# EAGLE design PCB1 (EAGLE 9.6.2)

## Sheet 1 of 2: CONEXIONES
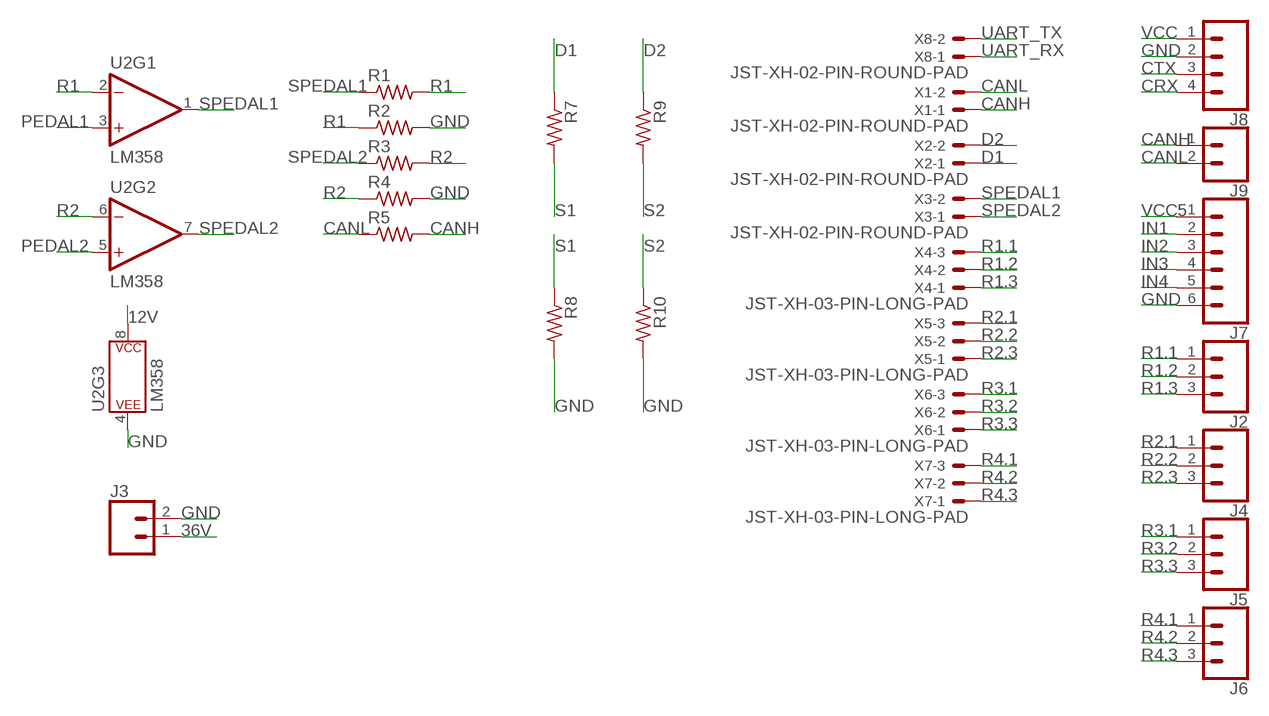
[diagram p0: schematic, sheet 1]

### Parts
J2  CONN_03  [1X03]
J3  CONN_025MM  [SCREWTERMINAL-5MM-2]
J4  CONN_03  [1X03]
J5  CONN_03  [1X03]
J6  CONN_03  [1X03]
J7  CONN_06SILK_FEMALE_PTH  [1X06]
J8  CONN_04  [1X04]
J9  CONN_02  [1X02]
R1  R-US_0207/10  [0207/10]
R2  R-US_0207/10  [0207/10]
R3  R-US_0207/10  [0207/10]
R4  R-US_0207/10  [0207/10]
R5  R-US_0207/10  [0207/10]
R7  R-US_0207/10  [0207/10]
R8  R-US_0207/10  [0207/10]
R9  R-US_0207/10  [0207/10]
R10  R-US_0207/10  [0207/10]
U2  LM358  [DIP08]
X1  JST-XH-02-PIN-ROUND-PAD  [JST-XH-02-PACKAGE-ROUND-PAD]
X2  JST-XH-02-PIN-ROUND-PAD  [JST-XH-02-PACKAGE-ROUND-PAD]
X3  JST-XH-02-PIN-ROUND-PAD  [JST-XH-02-PACKAGE-ROUND-PAD]
X4  JST-XH-03-PIN-LONG-PAD  [JST-XH-03-PACKAGE-LONG-PAD]
X5  JST-XH-03-PIN-LONG-PAD  [JST-XH-03-PACKAGE-LONG-PAD]
X6  JST-XH-03-PIN-LONG-PAD  [JST-XH-03-PACKAGE-LONG-PAD]
X7  JST-XH-03-PIN-LONG-PAD  [JST-XH-03-PACKAGE-LONG-PAD]
X8  JST-XH-02-PIN-ROUND-PAD  [JST-XH-02-PACKAGE-ROUND-PAD]

### Nets
12V: U2.8(P$V+) ; also sheet 2
36V: J3.1 ; also sheet 2
CANH: J9.1 R5.2 X1.1
CANL: J9.2 R5.1 X1.2
CRX: J8.4 ; also sheet 2
CTX: J8.3 ; also sheet 2
D1: R7.1 X2.1
D2: R9.1 X2.2
GND: J3.2 J7.6 J8.2 R2.2 R4.2 R8.2 R10.2 U2.4(P$V-) ; also sheet 2
IN1: J7.2 ; also sheet 2
IN2: J7.3 ; also sheet 2
IN3: J7.4 ; also sheet 2
IN4: J7.5 ; also sheet 2
PEDAL1: U2.3(+IN) ; also sheet 2
PEDAL2: U2.5(+IN) ; also sheet 2
R1: R1.2 R2.1 U2.2(-IN)
R1.1: J2.1 X4.3
R1.2: J2.2 X4.2
R1.3: J2.3 X4.1
R2: R3.2 R4.1 U2.6(-IN)
R2.1: J4.1 X5.3
R2.2: J4.2 X5.2
R2.3: J4.3 X5.1
R3.1: J5.1 X6.3
R3.2: J5.2 X6.2
R3.3: J5.3 X6.1
R4.1: J6.1 X7.3
R4.2: J6.2 X7.2
R4.3: J6.3 X7.1
S1: R7.2 R8.1 ; also sheet 2
S2: R9.2 R10.1 ; also sheet 2
SPEDAL1: R1.1 U2.1(OUT) X3.2
SPEDAL2: R3.1 U2.7(OUT) X3.1
UART_RX: X8.1 ; also sheet 2
UART_TX: X8.2 ; also sheet 2
VCC: J8.1 ; also sheet 2
VCC5: J7.1 ; also sheet 2

## Sheet 2 of 2: STM32 | REGULADOR
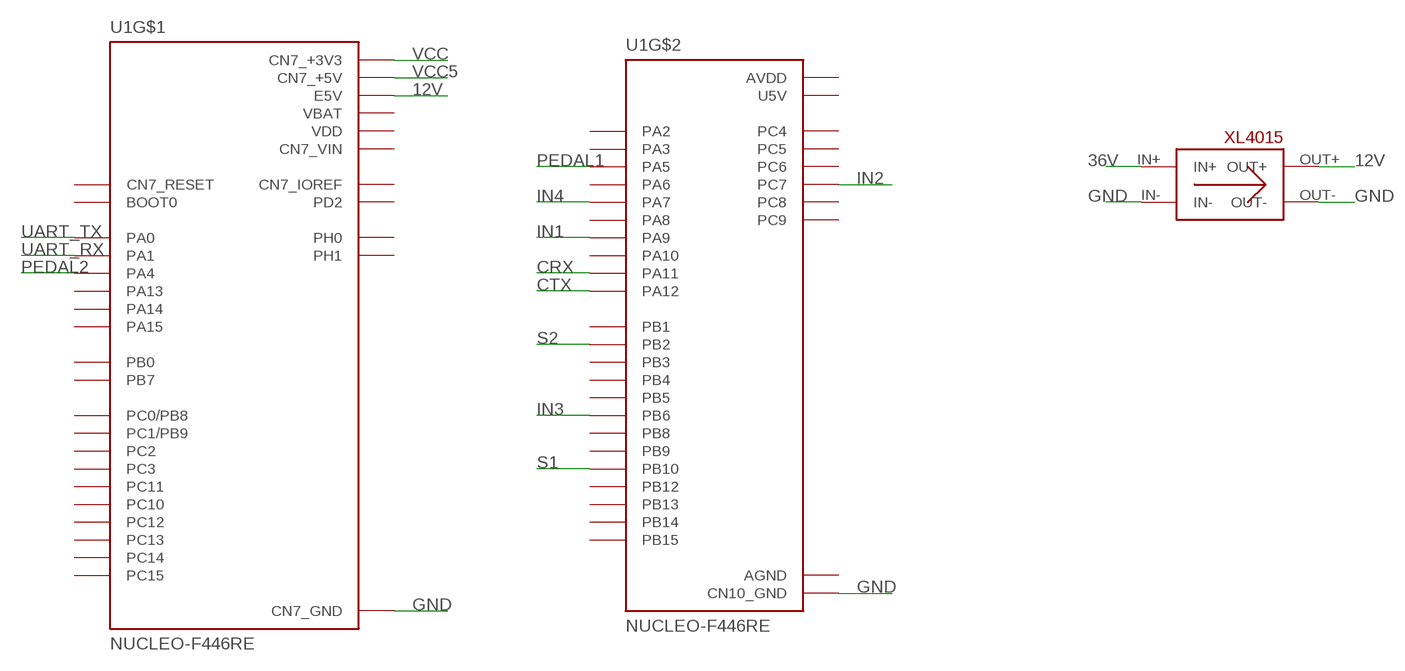
[diagram p1: schematic, sheet 2]

### Parts
U1  NUCLEO-F446RE  [MODULE_NUCLEO-F446RE]
U$4  XL4015  [XL4015]

### Nets
12V: U1.CN7_6(E5V) U$4.OUT+ ; also sheet 1
36V: U$4.IN+ ; also sheet 1
CRX: U1.CN10_14(PA11) ; also sheet 1
CTX: U1.CN10_12(PA12) ; also sheet 1
GND: U1.CN7_8(CN7_GND) U1.CN7_19(CN7_GND) U1.CN7_20(CN7_GND) U1.CN7_22(CN7_GND) U1.CN10_9(CN10_GND) U1.CN10_20(CN10_GND) U$4.IN- U$4.OUT- ; also sheet 1
IN1: U1.CN10_21(PA9) ; also sheet 1
IN2: U1.CN10_19(PC7) ; also sheet 1
IN3: U1.CN10_17(PB6) ; also sheet 1
IN4: U1.CN10_15(PA7) ; also sheet 1
PEDAL1: U1.CN10_11(PA5) ; also sheet 1
PEDAL2: U1.CN7_32(PA4) ; also sheet 1
S1: U1.CN10_25(PB10) ; also sheet 1
S2: U1.CN10_22(PB2) ; also sheet 1
UART_RX: U1.CN7_30(PA1) ; also sheet 1
UART_TX: U1.CN7_28(PA0) ; also sheet 1
VCC: U1.CN7_16(CN7_+3V3) ; also sheet 1
VCC5: U1.CN7_18(CN7_+5V) ; also sheet 1
Unconnected: U1.CN7_1(PC10) U1.CN7_2(PC11) U1.CN7_3(PC12) U1.CN7_4(PD2) U1.CN7_7(BOOT0) U1.CN7_12(CN7_IOREF) U1.CN7_13(PA13) U1.CN7_14(CN7_RESET) U1.CN7_15(PA14) U1.CN7_17(PA15) U1.CN7_21(PB7) U1.CN7_23(PC13) U1.CN7_25(PC14) U1.CN7_27(PC15) U1.CN7_29(PH0) U1.CN7_31(PH1) U1.CN7_34(PB0) U1.CN7_35(PC2) U1.CN7_36(PC1/PB9) U1.CN7_37(PC3) U1.CN7_38(PC0/PB8) U1.CN10_1(PC9) U1.CN10_2(PC8) U1.CN10_3(PB8) U1.CN10_4(PC6) U1.CN10_5(PB9) U1.CN10_6(PC5) U1.CN10_13(PA6) U1.CN10_16(PB12) U1.CN10_23(PA8) U1.CN10_24(PB1) U1.CN10_26(PB15) U1.CN10_27(PB4) U1.CN10_28(PB14) U1.CN10_29(PB5) U1.CN10_30(PB13) U1.CN10_31(PB3) U1.CN10_33(PA10) U1.CN10_34(PC4) U1.CN10_35(PA2) U1.CN10_37(PA3)

## Power pins joined to a net without a drawn wire
AGND: U1.CN10_32(AGND)
AVDD: U1.CN10_7(AVDD)
CN7_VIN: U1.CN7_24(CN7_VIN)
U5V: U1.CN10_8(U5V)
VBAT: U1.CN7_33(VBAT)
VDD: U1.CN7_5(VDD)

## Library data of the parts
J2 J4-J6 = SparkFun-Connectors:CONN_03: Multi connection point. Often used as Generic Header-pin footprint for 0.1 inch spaced/style header connections On any of the 0.1 inch spaced packages, you can populate with these: Break Away Headers - Straight <https://www.sparkfun.com/products/116> (PRT-00116) Break Away Male Headers - Right Angle <https://www.sparkfun.com/products/553> (PRT-00553) Female Headers <https://www.sparkfun.com/products/115> (PRT-00115) Break Away Headers - Machine Pin <https://www.sparkfun.com/products/117> (PRT-00117) Break Away Female Headers - Swiss Machine Pin <https://www.sparkfun.com/products/743> (PRT-00743) Stackable Header - 3 Pin (Female, 0.1") <https://www.sparkfun.com/products/13875> (PRT-13875) For SCREWTERMINALS and SPRING TERMINALS visit here: Screw Terimnals on SparkFun.com <https://www.sparkfun.com/search/results?term=Screw+Terminals> (5mm/3.5mm/2.54mm spacing) This device is also useful as a general connection point to wire up your design to another part of your project. Our various solder wires solder well into these plated through hole pads. Hook-Up Wire - Assortment (Stranded, 22 AWG) <https://www.sparkfun.com/products/11375> (PRT-11375) Hook-Up Wire - Assortment (Solid Core, 22 AWG) <https://www.sparkfun.com/products/11367> (PRT-11367) View the entire wire category on our website here <https://www.sparkfun.com/categories/141> Special notes: Molex polarized connector foot print use with SKU : PRT-08232 with associated crimp pins and housings.
J3 = SparkFun-Connectors:CONN_02: Multi connection point. Often used as Generic Header-pin footprint for 0.1 inch spaced/style header connections On any of the 0.1 inch spaced packages, you can populate with these: Break Away Headers - Straight <https://www.sparkfun.com/products/116> (PRT-00116) Break Away Male Headers - Right Angle <https://www.sparkfun.com/products/553> (PRT-00553) Female Headers <https://www.sparkfun.com/products/115> (PRT-00115) Break Away Headers - Machine Pin <https://www.sparkfun.com/products/117> (PRT-00117) Break Away Female Headers - Swiss Machine Pin <https://www.sparkfun.com/products/743> (PRT-00743) For SCREWTERMINALS and SPRING TERMINALS visit here: Screw Terimnals on SparkFun.com <https://www.sparkfun.com/search/results?term=Screw+Terminals> (5mm/3.5mm/2.54mm spacing) This device is also useful as a general connection point to wire up your design to another part of your project. Our various solder wires solder well into these plated through hole pads. Hook-Up Wire - Assortment (Stranded, 22 AWG) <https://www.sparkfun.com/products/11375> (PRT-11375) Hook-Up Wire - Assortment (Solid Core, 22 AWG) <https://www.sparkfun.com/products/11367> (PRT-11367) View the entire wire category on our website here <https://www.sparkfun.com/categories/141> Special notes: Molex polarized connector foot print use with: PRT-08233 with associated crimp pins and housings. 2.54_SCREWTERM for use with PRT-10571. 3.5mm Screw Terminal footprints for PRT-08084 5mm Screw Terminal footprints for use with PRT-08432; SF_SKU: PRT-08432
J7 = SparkFun-Connectors:CONN_06: Multi connection point. Often used as Generic Header-pin footprint for 0.1 inch spaced/style header connections On any of the 0.1 inch spaced packages, you can populate with these: Break Away Headers - Straight <https://www.sparkfun.com/products/116> (PRT-00116) Break Away Male Headers - Right Angle <https://www.sparkfun.com/products/553> (PRT-00553) Female Headers <https://www.sparkfun.com/products/115> (PRT-00115) Break Away Headers - Machine Pin <https://www.sparkfun.com/products/117> (PRT-00117) Break Away Female Headers - Swiss Machine Pin <https://www.sparkfun.com/products/743> (PRT-00743) Arduino Stackable Header - 6 Pin <https://www.sparkfun.com/products/9280> (PRT-09280) For SCREWTERMINALS and SPRING TERMINALS visit here: Screw Terimnals on SparkFun.com <https://www.sparkfun.com/search/results?term=Screw+Terminals> (5mm/3.5mm/2.54mm spacing) This device is also useful as a general connection point to wire up your design to another part of your project. Our various solder wires solder well into these plated through hole pads. Hook-Up Wire - Assortment (Stranded, 22 AWG) <https://www.sparkfun.com/products/11375> (PRT-11375) Hook-Up Wire - Assortment (Solid Core, 22 AWG) <https://www.sparkfun.com/products/11367> (PRT-11367) View the entire wire category on our website here <https://www.sparkfun.com/categories/141>; PROD_ID: CONN-08437
J8 = SparkFun-Connectors:CONN_04: Multi connection point. Often used as Generic Header-pin footprint for 0.1 inch spaced/style header connections On any of the 0.1 inch spaced packages, you can populate with these: Break Away Headers - Straight <https://www.sparkfun.com/products/116> (PRT-00116) Break Away Male Headers - Right Angle <https://www.sparkfun.com/products/553> (PRT-00553) Female Headers <https://www.sparkfun.com/products/115> (PRT-00115) Break Away Headers - Machine Pin <https://www.sparkfun.com/products/117> (PRT-00117) Break Away Female Headers - Swiss Machine Pin <https://www.sparkfun.com/products/743> (PRT-00743) For SCREWTERMINALS and SPRING TERMINALS visit here: Screw Terimnals on SparkFun.com <https://www.sparkfun.com/search/results?term=Screw+Terminals> (5mm/3.5mm/2.54mm spacing) This device is also useful as a general connection point to wire up your design to another part of your project. Our various solder wires solder well into these plated through hole pads. Hook-Up Wire - Assortment (Stranded, 22 AWG) <https://www.sparkfun.com/products/11375> (PRT-11375) Hook-Up Wire - Assortment (Solid Core, 22 AWG) <https://www.sparkfun.com/products/11367> (PRT-11367) View the entire wire category on our website here <https://www.sparkfun.com/categories/141> Special notes: Molex polarized connector foot print use with SKU : PRT-08231 with associated crimp pins and housings. 1MM SMD Version SKU: PRT-10208; PROD_ID: CONN-09696
J9 = SparkFun-Connectors:CONN_02: Multi connection point. Often used as Generic Header-pin footprint for 0.1 inch spaced/style header connections On any of the 0.1 inch spaced packages, you can populate with these: Break Away Headers - Straight <https://www.sparkfun.com/products/116> (PRT-00116) Break Away Male Headers - Right Angle <https://www.sparkfun.com/products/553> (PRT-00553) Female Headers <https://www.sparkfun.com/products/115> (PRT-00115) Break Away Headers - Machine Pin <https://www.sparkfun.com/products/117> (PRT-00117) Break Away Female Headers - Swiss Machine Pin <https://www.sparkfun.com/products/743> (PRT-00743) For SCREWTERMINALS and SPRING TERMINALS visit here: Screw Terimnals on SparkFun.com <https://www.sparkfun.com/search/results?term=Screw+Terminals> (5mm/3.5mm/2.54mm spacing) This device is also useful as a general connection point to wire up your design to another part of your project. Our various solder wires solder well into these plated through hole pads. Hook-Up Wire - Assortment (Stranded, 22 AWG) <https://www.sparkfun.com/products/11375> (PRT-11375) Hook-Up Wire - Assortment (Solid Core, 22 AWG) <https://www.sparkfun.com/products/11367> (PRT-11367) View the entire wire category on our website here <https://www.sparkfun.com/categories/141> Special notes: Molex polarized connector foot print use with: PRT-08233 with associated crimp pins and housings. 2.54_SCREWTERM for use with PRT-10571. 3.5mm Screw Terminal footprints for PRT-08084 5mm Screw Terminal footprints for use with PRT-08432
R1-R5 R7-R10 = resistor:R-US_: RESISTOR, American symbol
U1 = NUCLEO-F446RE:NUCLEO-F446RE: STM32 Nucleo-64 development board with STM32F446RET6 MCU, supports Arduino and ST morpho connectivity Check availability <https://pricing.snapeda.com/parts/NUCLEO-F446RE/STMicroelectronics/view-part?ref=eda>; AVAILABILITY: In Stock; CHECK_PRICES: https://www.snapeda.com/parts/NUCLEO-F446RE/STMicroelectronics/view-part/?ref=eda; DESCRIPTION: STM32F446RE, mbed-Enabled Development Nucleo-64 STM32F4 ARM® Cortex®-M4 MCU 32-Bit Embedded Evaluation Board; MF: STMicroelectronics; MP: NUCLEO-F446RE; PACKAGE: None; PRICE: None; PURCHASE-URL: https://www.snapeda.com/api/url_track_click_mouser/?unipart_id=284290&manufacturer=STMicroelectronics&part_name=NUCLEO-F446RE&search_term=None; SNAPEDA_LINK: https://www.snapeda.com/parts/NUCLEO-F446RE/STMicroelectronics/view-part/?ref=snap
U2 = Sparkfun_amplifiers:LM358: LM358 Jellybean op-amp Datasheet <http://www.sparkfun.com/datasheets/Components/General/LM358.pdf> SparkFun Products Op-Amp (Thru-Hole) - LM358 <https://www.sparkfun.com/products/9456> (COM-09456); PROD_ID: IC-09172
U$4 = ReguladorXI4015:XL4015
X1-X3 X8 = Rembrandt Electronics - JST XH Connectors v1-0:JST-XH-02-PIN: JST XH Connector 2 Pin Wire to board connector. Pitch: 2,54 mm, (0.100") Number of pins: 2 Created by Rembrandt Electronics www.rembrandtelectronics.com
X4-X7 = Rembrandt Electronics - JST XH Connectors v1-0:JST-XH-03-PIN: JST XH Connector 2 Pin Wire to board connector. Pitch: 2,54 mm, (0.100") Number of pins: 3 Created by Rembrandt Electronics www.rembrandtelectronics.com

## Board
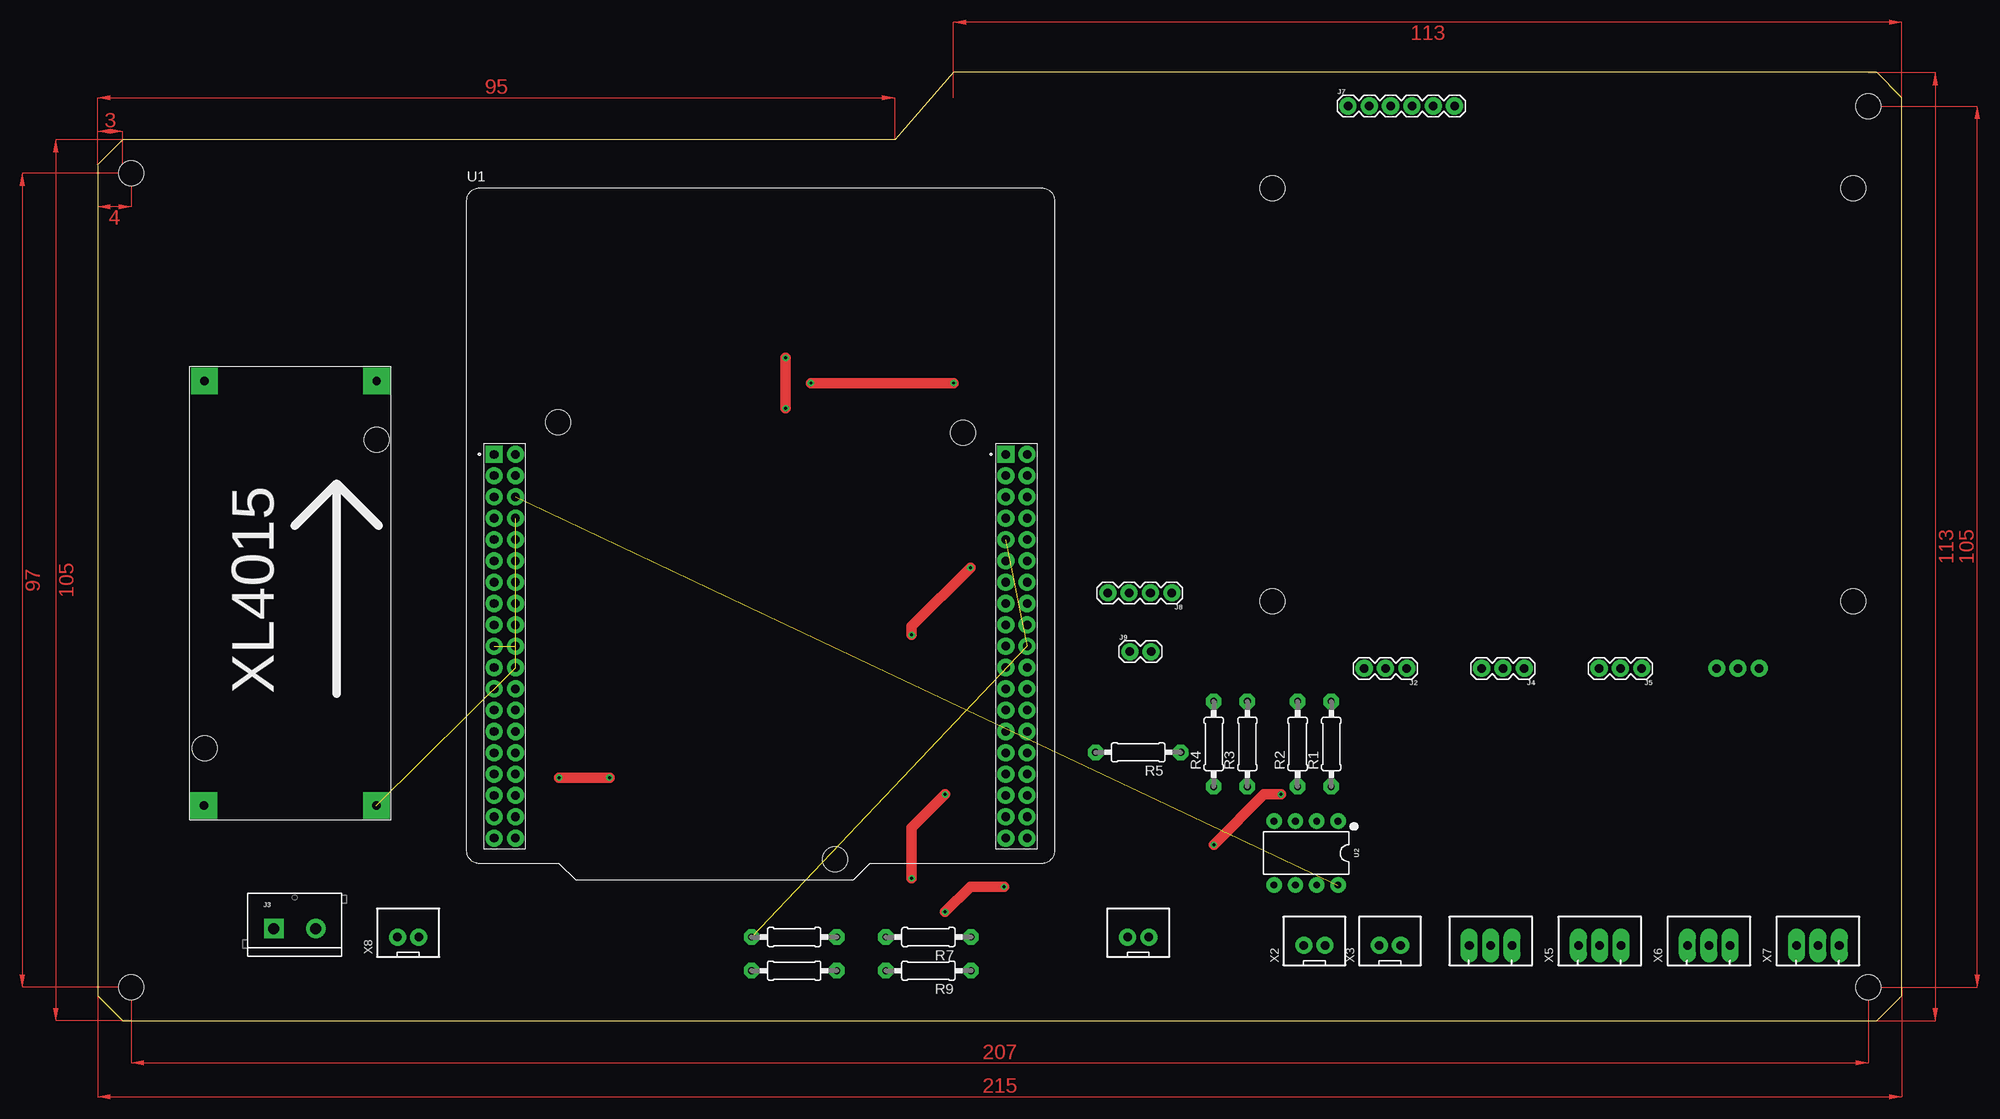
[diagram p2: board, top side]
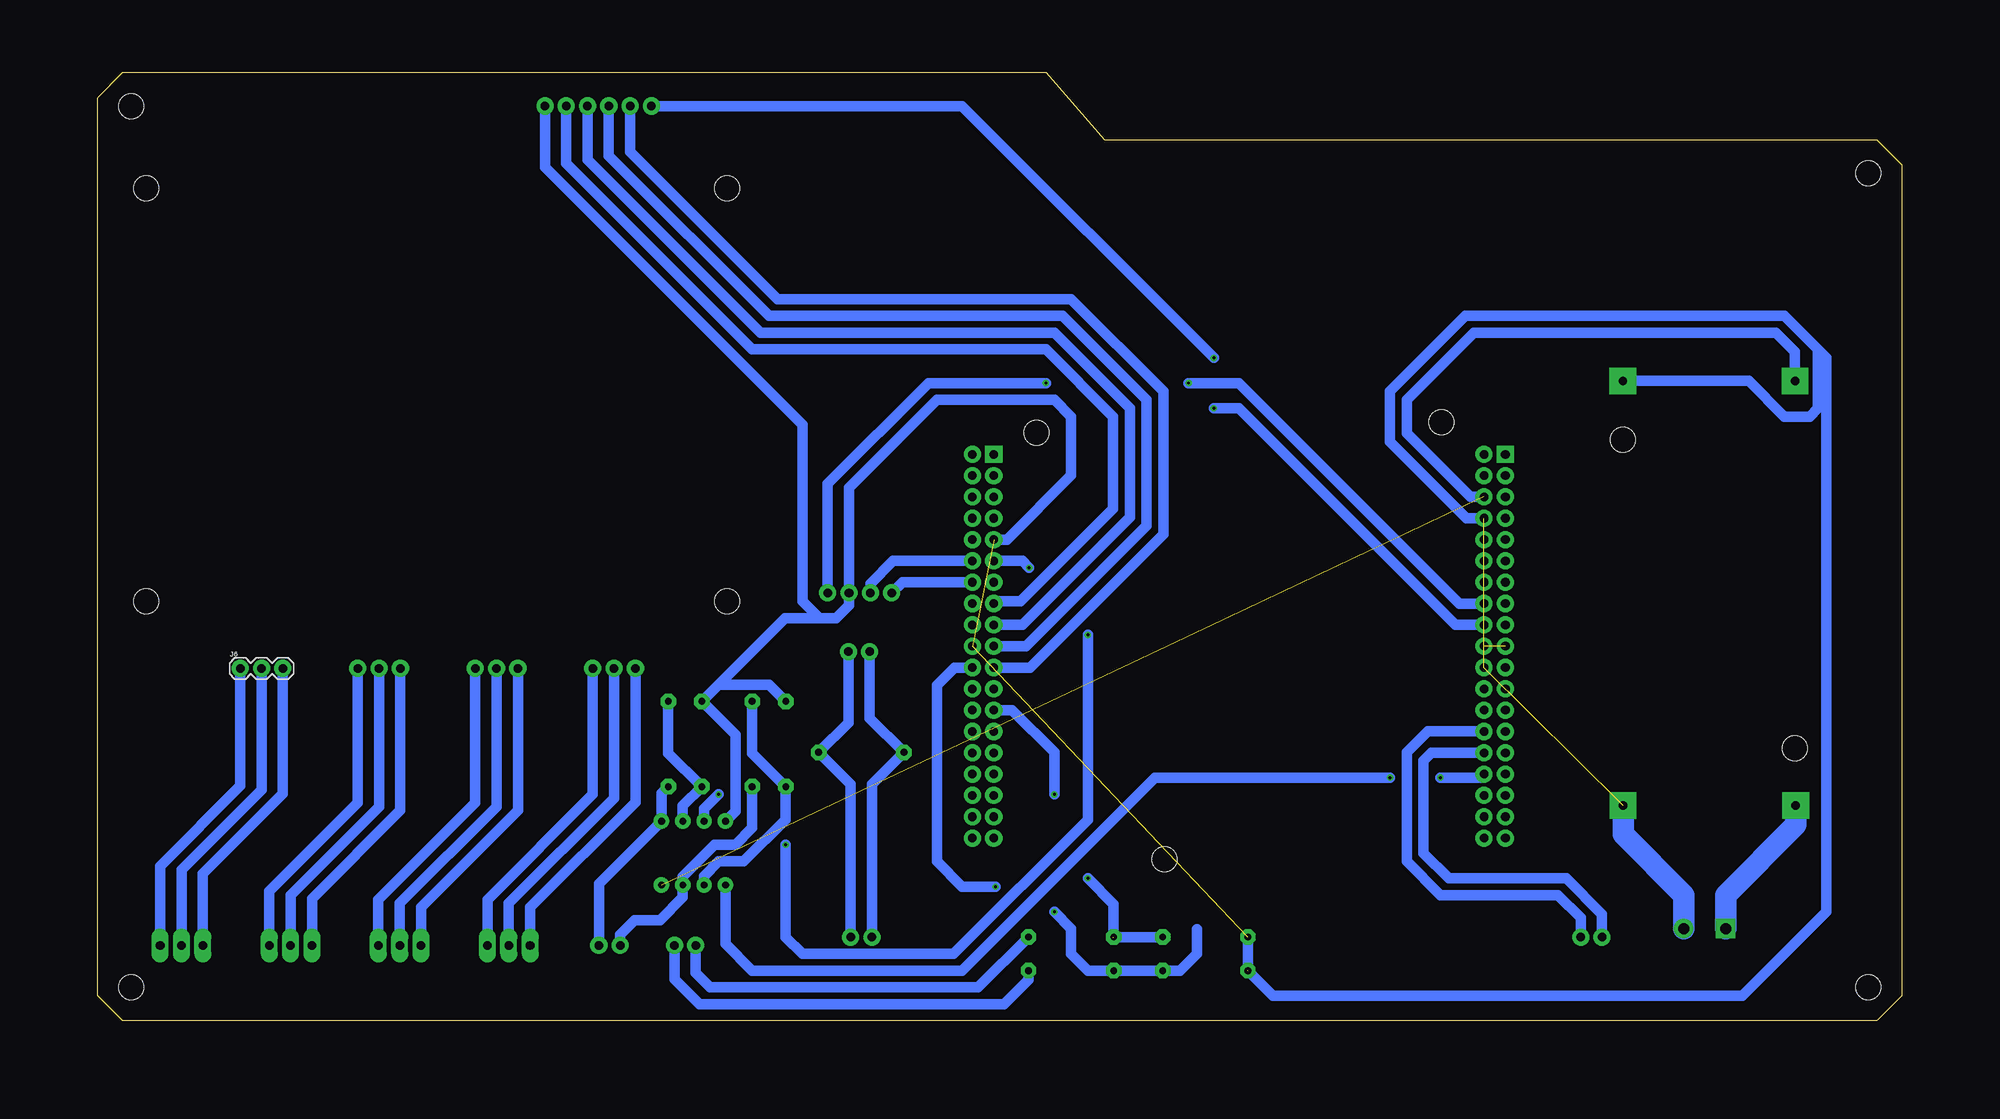
[diagram p3: board, bottom side, seen from below]

Size 215 x 113 mm. Coordinates in mm from the lower left corner, seen from the top.
Outline: 0,102 0,3 3,0 212,0 215,3 215,110 212,113 102,113 95,105 3,105 0,102
Copper layers (1*16): Top 0.035mm / dielectric 1.5mm / Bottom 0.035mm
Design rules "default *": minimum track width 6mil, minimum drill 0.35mm, track to track 6mil, track to pad 6mil, pad to pad 6mil, via to via 6mil, smd to smd 6mil, copper to edge 40mil, drill to drill 6mil, minimum pad ring 20mil, minimum via ring 8mil, stop-mask expansion 4mil, vias tented up to drill 0mil, thermal gap 10mil
Holes 3 mm at 140,99.21 209.22,99.21 209.22,50 4,4 211,4 4,101 211,109 140,50

### Footprints (pad centres in the part's own frame; a part is rotated, then mirrored left to right if it is on the bottom)
1X03 = drill 1.016 pad 1.88: 1 0,0; 2 2.54,0; 3 5.08,0
SCREWTERMINAL-5MM-2 = drill 1.3 pad 2.032 square: 1 0,0 | drill 1.3 pad 2.032: 2 5,0
1X06 = drill 1.016 pad 1.88: 1 0,0; 2 2.54,0; 3 5.08,0; 4 7.62,0; 5 10.16,0; 6 12.7,0
1X04 = drill 1.016 pad 1.88: 1 0,0; 2 2.54,0; 3 5.08,0; 4 7.62,0
1X02 = drill 1.016 pad 1.88: 1 0,0; 2 2.54,0
0207/10 = drill 0.813 octagon: 1 -5.08,0; 2 5.08,0
MODULE_NUCLEO-F446RE = drill 1.02 square: CN7_1 -31.75,9.51; CN10_1 29.21,9.51 | drill 1.02: CN7_2 -29.21,9.51; CN7_3 -31.75,6.97; CN7_4 -29.21,6.97; CN7_5 -31.75,4.43; CN7_6 -29.21,4.43; CN7_7 -31.75,1.89; CN7_8 -29.21,1.89; CN7_9 -31.75,-0.65; CN7_10 -29.21,-0.65; CN7_11 -31.75,-3.19; CN7_12 -29.21,-3.19; CN7_13 -31.75,-5.73; CN7_14 -29.21,-5.73; CN7_15 -31.75,-8.27; CN7_16 -29.21,-8.27; CN7_17 -31.75,-10.81; CN7_18 -29.21,-10.81; CN7_19 -31.75,-13.35; CN7_20 -29.21,-13.35; CN7_21 -31.75,-15.89; CN7_22 -29.21,-15.89; CN7_23 -31.75,-18.43; CN7_24 -29.21,-18.43; CN7_25 -31.75,-20.97; CN7_26 -29.21,-20.97; CN7_27 -31.75,-23.51; CN7_28 -29.21,-23.51; CN7_29 -31.75,-26.05; CN7_30 -29.21,-26.05; CN7_31 -31.75,-28.59; CN7_32 -29.21,-28.59; CN7_33 -31.75,-31.13; CN7_34 -29.21,-31.13; CN7_35 -31.75,-33.67; CN7_36 -29.21,-33.67; CN7_37 -31.75,-36.21; CN7_38 -29.21,-36.21; CN10_2 31.75,9.51; CN10_3 29.21,6.97; CN10_4 31.75,6.97; CN10_5 29.21,4.43; CN10_6 31.75,4.43; CN10_7 29.21,1.89; CN10_8 31.75,1.89; CN10_9 29.21,-0.65; CN10_10 31.75,-0.65; CN10_11 29.21,-3.19; CN10_12 31.75,-3.19; CN10_13 29.21,-5.73; CN10_14 31.75,-5.73; CN10_15 29.21,-8.27; CN10_16 31.75,-8.27; CN10_17 29.21,-10.81; CN10_18 31.75,-10.81; CN10_19 29.21,-13.35; CN10_20 31.75,-13.35; CN10_21 29.21,-15.89; CN10_22 31.75,-15.89; CN10_23 29.21,-18.43; CN10_24 31.75,-18.43; CN10_25 29.21,-20.97; CN10_26 31.75,-20.97; CN10_27 29.21,-23.51; CN10_28 31.75,-23.51; CN10_29 29.21,-26.05; CN10_30 31.75,-26.05; CN10_31 29.21,-28.59; CN10_32 31.75,-28.59; CN10_33 29.21,-31.13; CN10_34 31.75,-31.13; CN10_35 29.21,-33.67; CN10_36 31.75,-33.67; CN10_37 29.21,-36.21; CN10_38 31.75,-36.21 | hole 3: 8.89,-38.75; 24.13,12.05; -24.13,13.32
DIP08 = drill 0.813 pad 1.626: 1 -3.81,-3.81; 2 -1.27,-3.81; 3 1.27,-3.81; 4 3.81,-3.81; 5 3.81,3.81; 6 1.27,3.81; 7 -1.27,3.81; 8 -3.81,3.81
XL4015 = drill 1.016 pad 3.175 square: IN+ 1.651,1.651; IN- 22.221,1.651 | drill 1 pad 3.175 square: OUT+ 1.75,52.25; OUT- 22.25,52.25 | hole 3: 22.25,45.25; 1.75,8.5
JST-XH-02-PACKAGE-ROUND-PAD = drill 1.016: 1 -1.27,0; 2 1.27,0
JST-XH-03-PACKAGE-LONG-PAD = drill 1.016 long: 1 -2.54,0; 2 0,0; 3 2.54,0

### Placement (x,y rotation side)
J2  156,42 180 top
J3  21,11 0 top
J4  170,42 180 top
J5  184,42 180 top
J6  198,42 0 bottom
J7  149,109 0 top
J8  128,51 180 top
J9  123,44 0 top
R1  147,33 90 top
R2  143,33 90 top
R3  137,33 90 top
R4  133,33 90 top
R5  124,32 180 top
R7  99,10 180 top
R8  83,10 180 top
R9  99,6 180 top
R10  83,6 180 top
U1  79,58 0 top
U2  144,20 180 top
U$4  11,24 0 top
X1  124,10 0 top
X2  145,9 0 top
X3  154,9 0 top
X4  166,9 0 top
X5  179,9 0 top
X6  192,9 0 top
X7  205,9 0 top
X8  37,10 0 top

### Tracks (layer width: path | path; a pad name or v marks a point on that pad's centre or on a via)
12V  (1 unrouted)
  Bottom 1.27: U$4.OUT+ 12.75,79.75 15,82 51,82 59,74 59,70 51.43,62.43 U1.CN7_6
36V
  Bottom 2.54: J3.1 21,15 12.65,23.35 U$4.IN+
CANH
  Bottom 1.27: J9.1 123,36.08 R5.2 122.73,28.19 X1.1
CANL
  Bottom 1.27: J9.2 125.54,35.54 R5.1 125.27,28.19 X1.2
CRX
  Bottom 1.27: U1.CN10_14 119.11,52.27 J8.4
CTX
  Bottom 1.27: J8.3 122.92,52.08 120.19,54.81 U1.CN10_12
D1
  Bottom 1.27: X2.1 143.73,5.73 142,4 110.08,4 R7.1
D2
  Bottom 1.27: X2.2 146.27,5 143.27,2 107,2 104.08,4.92 R9.1
GND  (7 unrouted)
  Bottom 1.27: J7.6 161.7,101.7 131,71 131,50 129,48 | U1.CN10_9 106.65,57.35 99,65 99,72 101,74 115,74 125.46,63.54 J8.2 125.46,49.54 127,48 129,48 | 10,80 10,73 11,72 14,72 18.25,76.25 U$4.OUT- | 10,80 14,84 52,84 61,75 61,69 51.89,59.89 U1.CN7_8 | 10,80 9,79 9,13 19,3 74.92,3 R10.2 | R2.2 133.08,48 129,48 | R4.2 135,40.08 141,40.08 R2.2 | R8.2 77.92,6.08 78,6 | U2.4 139,25 139,34.08 R2.2
  Bottom 2.54: J3.2 26,15 33.22,22.22 U$4.IN-
IN1
  Bottom 1.27: U1.CN10_21 103.89,42.11 88,58 88,75 99,86 134,86 151.54,103.54 J7.2
IN2
  Bottom 1.27: U1.CN10_19 104.35,44.65 90,59 90,74 100,84 135,84 154.08,103.08 J7.3
IN3
  Bottom 1.27: U1.CN10_17 104.81,47.19 92,60 92,73 101,82 136,82 156.62,102.62 J7.4
IN4
  Bottom 1.27: U1.CN10_15 107.94,50 105,50 94,61 94,72 102,80 137,80 159.16,102.16 J7.5
PEDAL1  (via drill 0.35)
  Top 1.27: v141,27 139,27 v133,21 | v97,46 97,47 v104,54
  Bottom 1.27: U2.3 142.73,25.27 v141,27 | v133,21 133,10 131,8 113,8 97,24 v97,46 | v104,54 104.81,54.81 U1.CN10_11
PEDAL2  (via drill 0.35)
  Top 1.27: v61,29 v55,29
  Bottom 1.27: U2.5 140.19,9.19 137,6 112,6 89,29 v61,29 | v55,29 50.2,29 U1.CN7_32
R1
  Bottom 1.27: R1.2 147,31.92 R2.1 145.27,25.65 U2.2
R1.1
  Bottom 1.27: X4.3 168.54,14.46 156,27 J2.1
R1.2
  Bottom 1.27: J2.2 153.46,26.54 166,14 X4.2
R1.3
  Bottom 1.27: J2.3 150.92,26.08 163.46,13.54 X4.1
R2
  Bottom 1.27: R3.2 137,31.92 R4.1 133,24 138,19 141,19 142.73,17.27 U2.6
R2.1
  Bottom 1.27: X5.3 181.54,14.46 170,26 J4.1
R2.2
  Bottom 1.27: X5.2 179,14 167.46,25.54 J4.2
R2.3
  Bottom 1.27: X5.1 176.46,13.54 164.92,25.08 J4.3
R3.1
  Bottom 1.27: X6.3 194.54,15.46 184,26 J5.1
R3.2
  Bottom 1.27: X6.2 192,15 181.46,25.54 J5.2
R3.3
  Bottom 1.27: X6.1 189.46,14.54 178.92,25.08 J5.3
R4.1
  Bottom 1.27: X7.3 207.54,18.46 198,28 J6.1
R4.2
  Bottom 1.27: X7.2 205,18 195.46,27.54 J6.2
R4.3
  Bottom 1.27: X7.1 202.46,17.54 192.92,27.08 J6.3
S1  (via drill 0.35)  (1 unrouted)
  Top 1.27: v97,17 97,23 v101,27
  Bottom 1.27: R8.1 94,10 | R7.2 93.92,13.92 v97,17 | v101,27 101,32 106.03,37.03 U1.CN10_25
S2  (via drill 0.35)
  Top 1.27: v101,13 104,16 v108,16
  Bottom 1.27: 84,10.9 84,8 86,6 R10.1 R9.2 97,6 99,8 99,11 v101,13 | v108,16 112,16 115,19 115,40 112.89,42.11 U1.CN10_22
SPEDAL1
  Bottom 1.27: X3.2 155.27,16.35 U2.1 147.81,27.11 R1.1
SPEDAL2
  Bottom 1.27: X3.1 152.73,10.27 151,12 148,12 145.27,14.73 U2.7 145.27,17.19 141.46,21 139,21 137,23 R3.1
UART_RX
  Bottom 1.27: X8.1 35.73,12.73 40,17 54,17 57,20 57,31 56.05,31.95 U1.CN7_30
UART_TX
  Bottom 1.27: X8.2 38.27,12.27 41,15 55,15 59,19 59,32 56.51,34.49 U1.CN7_28
VCC  (via drill 0.35)
  Top 1.27: v85,76 v102,76
  Bottom 1.27: J8.1 128,64 116,76 v102,76 | U1.CN7_16 52.73,49.73 79,76 v85,76
VCC5  (via drill 0.35)
  Top 1.27: v82,73 v82,79
  Bottom 1.27: U1.CN7_18 53.19,47.19 79,73 v82,73 | v82,79 112,109 J7.1
(copper drawn outside any net)
  shapes: Top area x10